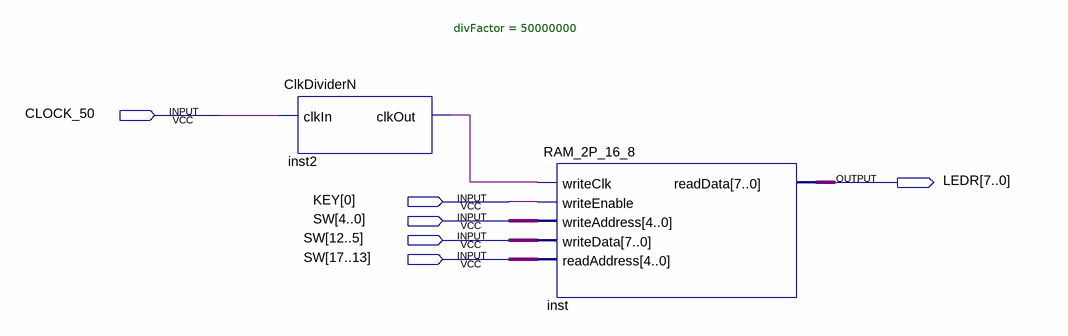
[diagram p0: schematic sheet]
// Quartus schematic RAM_2P_Demo.bdf as structural Verilog: 2 symbols, 6 pins
module RAM_2P_Demo (
  input  CLOCK_50,
  input  [0:0] KEY,
  input  [17:0] SW,
  output [7:0] LEDR
);

  wire inst2_clkout;

  ClkDividerN #(.divFactor(50000000)) inst2 (.clkIn(CLOCK_50), .clkOut(inst2_clkout));
  RAM_2P_16_8 inst (
    .writeClk(inst2_clkout), .writeEnable(KEY[0]), .writeAddress(SW[4:0]), .writeData(SW[12:5]),
    .readAddress(SW[17:13]), .readData(LEDR));
endmodule
